# EAGLE schematic shield_horizontal_2 (EAGLE 6.5.0)
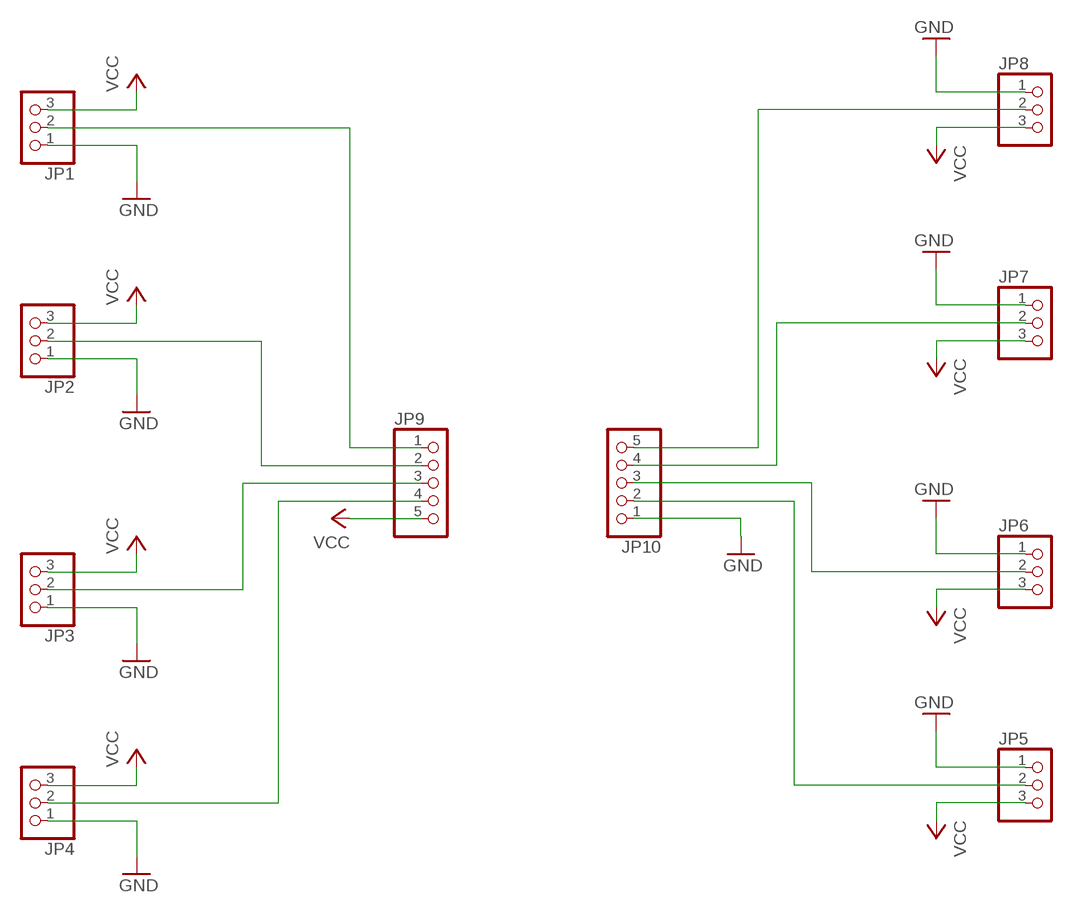
[diagram p0: schematic, sheet 1]

## Parts
JP1  PINHD-1X3PS  [1X03-POTENTIOSHIELD]
JP2  PINHD-1X3PS  [1X03-POTENTIOSHIELD]
JP3  PINHD-1X3PS  [1X03-POTENTIOSHIELD]
JP4  PINHD-1X3PS  [1X03-POTENTIOSHIELD]
JP5  PINHD-1X3PS  [1X03-POTENTIOSHIELD]
JP6  PINHD-1X3PS  [1X03-POTENTIOSHIELD]
JP7  PINHD-1X3PS  [1X03-POTENTIOSHIELD]
JP8  PINHD-1X3PS  [1X03-POTENTIOSHIELD]
JP9  PINHD-1X5  [1X05]
JP10  PINHD-1X5  [1X05]

## Nets
GND: JP1.1 JP2.1 JP3.1 JP4.1 JP5.1 JP6.1 JP7.1 JP8.1 JP10.1
N$1: JP1.2 JP9.1
N$2: JP2.2 JP9.2
N$3: JP3.2 JP9.3
N$4: JP4.2 JP9.4
N$5: JP5.2 JP10.2
N$6: JP6.2 JP10.3
N$7: JP7.2 JP10.4
N$8: JP8.2 JP10.5
VCC: JP1.3 JP2.3 JP3.3 JP4.3 JP5.3 JP6.3 JP7.3 JP8.3 JP9.5

## Library data of the parts
JP1-JP8 = manticore-lib:PINHD-1X3: PIN HEADER
JP9 JP10 = manticore-lib:PINHD-1X5: PIN HEADER